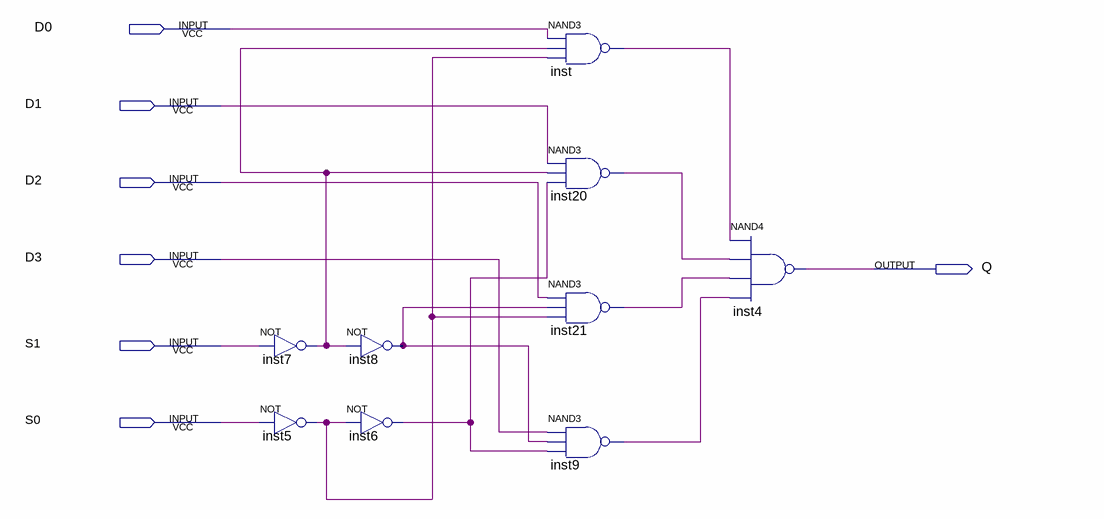
[diagram p0: schematic sheet]
// Quartus schematic multichoose_sche.bdf as structural Verilog: 9 symbols, 7 pins
module multichoose_sche (
  input  D0,
  input  D1,
  input  D2,
  input  D3,
  input  S1,
  input  S0,
  output Q
);

  wire inst5_out, inst6_out, inst7_out, inst8_out, inst9_out, inst20_out, inst21_out, inst_out;

  not inst7 (inst7_out, S1);
  not inst5 (inst5_out, S0);
  not inst8 (inst8_out, inst7_out);
  not inst6 (inst6_out, inst5_out);
  nand inst (inst_out, D0, inst7_out, inst5_out);
  nand inst20 (inst20_out, D1, inst7_out, inst6_out);
  nand inst21 (inst21_out, D2, inst8_out, inst5_out);
  nand inst9 (inst9_out, D3, inst8_out, inst6_out);
  nand inst4 (Q, inst_out, inst20_out, inst21_out, inst9_out);
endmodule
